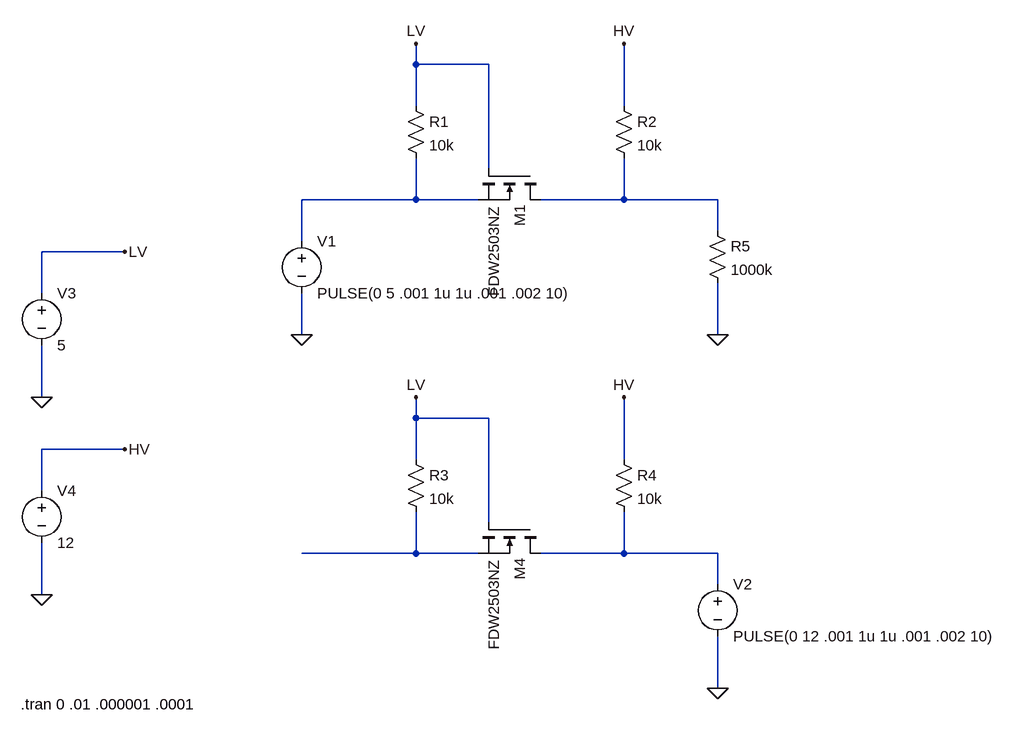
[diagram p0: schematic BiDirectional_Level_Shifter.asc]
BiDirectional_Level_Shifter.asc, the LTspice schematic file:
Version 4
SHEET 1 1088 680
WIRE 160 -960 160 -992
WIRE 272 -960 160 -960
WIRE 160 -896 160 -960
WIRE 480 -896 480 -992
WIRE 272 -800 272 -960
WIRE 160 -752 160 -816
WIRE 160 -752 -16 -752
WIRE 256 -752 160 -752
WIRE 480 -752 480 -816
WIRE 480 -752 352 -752
WIRE 624 -752 480 -752
WIRE 624 -704 624 -752
WIRE -16 -688 -16 -752
WIRE -288 -672 -416 -672
WIRE -416 -608 -416 -672
WIRE -16 -544 -16 -608
WIRE 624 -544 624 -624
WIRE -416 -448 -416 -528
WIRE 160 -416 160 -448
WIRE 272 -416 160 -416
WIRE -288 -368 -416 -368
WIRE 160 -352 160 -416
WIRE 480 -352 480 -448
WIRE -416 -304 -416 -368
WIRE 272 -256 272 -416
WIRE 160 -208 160 -272
WIRE 160 -208 -16 -208
WIRE 256 -208 160 -208
WIRE 480 -208 480 -272
WIRE 480 -208 352 -208
WIRE 624 -208 480 -208
WIRE 624 -160 624 -208
WIRE -416 -144 -416 -224
WIRE 624 0 624 -80
FLAG 160 -992 LV
FLAG 480 -992 HV
FLAG -16 -544 0
FLAG -416 -144 0
FLAG -416 -448 0
FLAG -288 -672 LV
FLAG -288 -368 HV
FLAG 160 -448 LV
FLAG 480 -448 HV
FLAG 624 0 0
FLAG 624 -544 0
SYMBOL nmos 352 -800 R90
SYMATTR InstName M1
SYMATTR Value FDW2503NZ
SYMBOL voltage -16 -704 R0
WINDOW 123 0 0 Left 0
WINDOW 39 0 0 Left 0
SYMATTR InstName V1
SYMATTR Value PULSE(0 5 .001 1u 1u .001 .002 10)
SYMBOL res 144 -912 R0
SYMATTR InstName R1
SYMATTR Value 10k
SYMBOL res 464 -912 R0
SYMATTR InstName R2
SYMATTR Value 10k
SYMBOL voltage -416 -320 R0
WINDOW 123 0 0 Left 0
WINDOW 39 0 0 Left 0
SYMATTR InstName V4
SYMATTR Value 12
SYMBOL voltage -416 -624 R0
WINDOW 123 0 0 Left 0
WINDOW 39 0 0 Left 0
SYMATTR InstName V3
SYMATTR Value 5
SYMBOL res 144 -368 R0
SYMATTR InstName R3
SYMATTR Value 10k
SYMBOL res 464 -368 R0
SYMATTR InstName R4
SYMATTR Value 10k
SYMBOL voltage 624 -176 R0
WINDOW 123 0 0 Left 0
WINDOW 39 0 0 Left 0
SYMATTR InstName V2
SYMATTR Value PULSE(0 12 .001 1u 1u .001 .002 10)
SYMBOL res 608 -720 R0
SYMATTR InstName R5
SYMATTR Value 1000k
SYMBOL nmos 352 -256 R90
SYMATTR InstName M4
SYMATTR Value FDW2503NZ
TEXT -448 24 Left 2 !.tran 0 .01 .000001 .0001

The netlist it stands for:
* BiDirectional_Level_Shifter.asc
M1 N002 LV N001 N001 FDW2503NZ
V1 N001 0 PULSE(0 5 .001 1u 1u .001 .002 10)
R1 LV N001 10k
R2 HV N002 10k
V4 HV 0 12
V3 LV 0 5
R3 LV N003 10k
R4 HV N004 10k
V2 N004 0 PULSE(0 12 .001 1u 1u .001 .002 10)
R5 N002 0 1000k
M4 N004 LV N003 N003 FDW2503NZ
.model NMOS NMOS
.model PMOS PMOS
.lib standard.mos
.tran 0 .01 .000001 .0001
.backanno
.end